# Altium schematic sheet LCD_NET_GPIO_JTAG_SD_USB.SchDoc
size A4; SheetNumber: 4; SheetTotal: 5
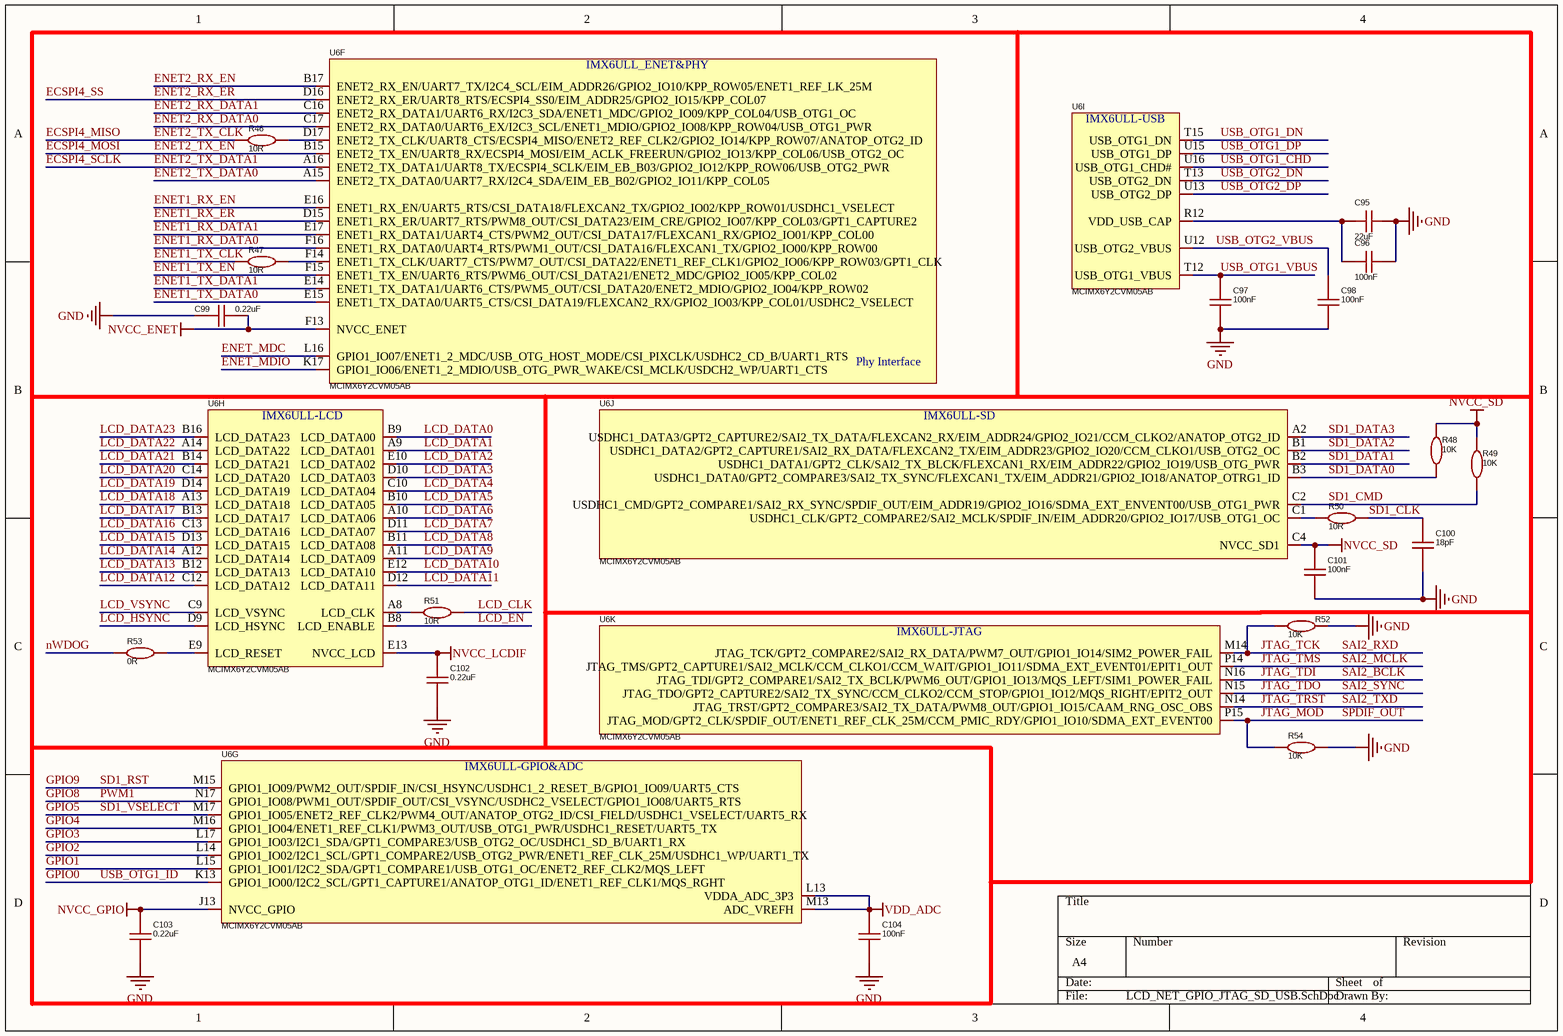
[diagram p0: LCD_NET_GPIO_JTAG_SD_USB.SchDoc]

## Parts
C95  22uF  [C0603]
C96  100nF  [C0402]
C97  100nF  [C0402]
C98  100nF  [C0402]
C99  0.22uF  [C0402]
C100  18pF  [C0402]
C101  100nF  [C0402]
C102  0.22uF  [C0402]
C103  0.22uF  [C0402]
C104  100nF  [C0402]
R46  10R  [R0402]
R47  10R  [R0402]
R48  10K  [R0402]
R49  10K  [R0402]
R50  10R  [R0402]
R51  10R  [R0402]
R52  10K  [R0402]
R53  0R  [R0402]
R54  10K  [R0402]
U6  MCIMX6Y2CVM05AB  [BGA-289_L14.0-W14.0-R17-C17-P0.80-BL]  (parts F,G,H,I,J,K of 12)

## Nets
GND: C95.2 C96.2 C97.1 C98.1 C99.2 C100.1 C101.1 C102.2 C103.2 C104.1 R52.1 R54.1
NVCC_ENET: C99.1 U6.F13(NVCC_ENET)
NVCC_GPIO: C103.1 U6.J13(NVCC_GPIO)
NVCC_LCDIF: C102.1 U6.E13(NVCC_LCD)
NVCC_SD: C101.2 R48.2 R49.2 U6.C4(NVCC_SD1)
VDD_ADC: C104.2 U6.L13(VDDA_ADC_3P3) U6.M13(ADC_VREFH)
ECSPI4_MISO: R46.1  [also labelled ENET2_TX_CLK]
ECSPI4_MOSI: U6.B15(ENET2_TX_EN/UART8_RX/ECSPI4_MOSI/EIM_ACLK_FREERUN/GPIO2_IO13/KPP_COL06/USB_OTG2_OC)  [also labelled ENET2_TX_EN]
ECSPI4_SCLK: U6.A16(ENET2_TX_DATA1/UART8_TX/ECSPI4_SCLK/EIM_EB_B03/GPIO2_IO12/KPP_ROW06/USB_OTG2_PWR)  [also labelled ENET2_TX_DATA1]
ECSPI4_SS: U6.D16(ENET2_RX_ER/UART8_RTS/ECSPI4_SS0/EIM_ADDR25/GPIO2_IO15/KPP_COL07)  [also labelled ENET2_RX_ER]
ENET1_RX_DATA0: U6.F16(ENET1_RX_DATA0/UART4_RTS/PWM1_OUT/CSI_DATA16/FLEXCAN1_TX/GPIO2_IO00/KPP_ROW00)
ENET1_RX_DATA1: U6.E17(ENET1_RX_DATA1/UART4_CTS/PWM2_OUT/CSI_DATA17/FLEXCAN1_RX/GPIO2_IO01/KPP_COL00)
ENET1_RX_EN: U6.E16(ENET1_RX_EN/UART5_RTS/CSI_DATA18/FLEXCAN2_TX/GPIO2_IO02/KPP_ROW01/USDHC1_VSELECT)
ENET1_RX_ER: U6.D15(ENET1_RX_ER/UART7_RTS/PWM8_OUT/CSI_DATA23/EIM_CRE/GPIO2_IO07/KPP_COL03/GPT1_CAPTURE2)
ENET1_TX_CLK: R47.1
ENET1_TX_DATA0: U6.E15(ENET1_TX_DATA0/UART5_CTS/CSI_DATA19/FLEXCAN2_RX/GPIO2_IO03/KPP_COL01/USDHC2_VSELECT)
ENET1_TX_DATA1: U6.E14(ENET1_TX_DATA1/UART6_CTS/PWM5_OUT/CSI_DATA20/ENET2_MDIO/GPIO2_IO04/KPP_ROW02)
ENET1_TX_EN: U6.F15(ENET1_TX_EN/UART6_RTS/PWM6_OUT/CSI_DATA21/ENET2_MDC/GPIO2_IO05/KPP_COL02)
ENET2_RX_DATA0: U6.C17(ENET2_RX_DATA0/UART6_EX/I2C3_SCL/ENET1_MDIO/GPIO2_IO08/KPP_ROW04/USB_OTG1_PWR)
ENET2_RX_DATA1: U6.C16(ENET2_RX_DATA1/UART6_RX/I2C3_SDA/ENET1_MDC/GPIO2_IO09/KPP_COL04/USB_OTG1_OC)
ENET2_RX_EN: U6.B17(ENET2_RX_EN/UART7_TX/I2C4_SCL/EIM_ADDR26/GPIO2_IO10/KPP_ROW05/ENET1_REF_LK_25M)
ENET2_TX_DATA0: U6.A15(ENET2_TX_DATA0/UART7_RX/I2C4_SDA/EIM_EB_B02/GPIO2_IO11/KPP_COL05)
ENET_MDC: U6.L16(GPIO1_IO07/ENET1_2_MDC/USB_OTG_HOST_MODE/CSI_PIXCLK/USDHC2_CD_B/UART1_RTS)
ENET_MDIO: U6.K17(GPIO1_IO06/ENET1_2_MDIO/USB_OTG_PWR_WAKE/CSI_MCLK/USDCH2_WP/UART1_CTS)
GPIO0: U6.K13(GPIO1_IO00/I2C2_SCL/GPT1_CAPTURE1/ANATOP_OTG1_ID/ENET1_REF_CLK1/MQS_RGHT)  [also labelled USB_OTG1_ID]
GPIO1: U6.L15(GPIO1_IO01/I2C2_SDA/GPT1_COMPARE1/USB_OTG1_OC/ENET2_REF_CLK2/MQS_LEFT)
GPIO2: U6.L14(GPIO1_IO02/I2C1_SCL/GPT1_COMPARE2/USB_OTG2_PWR/ENET1_REF_CLK_25M/USDHC1_WP/UART1_TX)
GPIO3: U6.L17(GPIO1_IO03/I2C1_SDA/GPT1_COMPARE3/USB_OTG2_OC/USDHC1_SD_B/UART1_RX)
GPIO4: U6.M16(GPIO1_IO04/ENET1_REF_CLK1/PWM3_OUT/USB_OTG1_PWR/USDHC1_RESET/UART5_TX)
GPIO5: U6.M17(GPIO1_IO05/ENET2_REF_CLK2/PWM4_OUT/ANATOP_OTG2_ID/CSI_FIELD/USDHC1_VSELECT/UART5_RX)  [also labelled SD1_VSELECT]
GPIO8: U6.N17(GPIO1_IO08/PWM1_OUT/SPDIF_OUT/CSI_VSYNC/USDHC2_VSELECT/GPIO1_IO08/UART5_RTS)  [also labelled PWM1]
GPIO9: U6.M15(GPIO1_IO09/PWM2_OUT/SPDIF_IN/CSI_HSYNC/USDHC1_2_RESET_B/GPIO1_IO09/UART5_CTS)  [also labelled SD1_RST]
JTAG_MOD: R54.2 U6.P15(JTAG_MOD/GPT2_CLK/SPDIF_OUT/ENET1_REF_CLK_25M/CCM_PMIC_RDY/GPIO1_IO10/SDMA_EXT_EVENT00)  [also labelled SPDIF_OUT]
JTAG_TCK: R52.2 U6.M14(JTAG_TCK/GPT2_COMPARE2/SAI2_RX_DATA/PWM7_OUT/GPIO1_IO14/SIM2_POWER_FAIL)  [also labelled SAI2_RXD]
JTAG_TDI: U6.N16(JTAG_TDI/GPT2_COMPARE1/SAI2_TX_BCLK/PWM6_OUT/GPIO1_IO13/MQS_LEFT/SIM1_POWER_FAIL)  [also labelled SAI2_BCLK]
JTAG_TDO: U6.N15(JTAG_TDO/GPT2_CAPTURE2/SAI2_TX_SYNC/CCM_CLKO2/CCM_STOP/GPIO1_IO12/MQS_RIGHT/EPIT2_OUT)  [also labelled SAI2_SYNC]
JTAG_TMS: U6.P14(JTAG_TMS/GPT2_CAPTURE1/SAI2_MCLK/CCM_CLKO1/CCM_WAIT/GPIO1_IO11/SDMA_EXT_EVENT01/EPIT1_OUT)  [also labelled SAI2_MCLK]
JTAG_TRST: U6.N14(JTAG_TRST/GPT2_COMPARE3/SAI2_TX_DATA/PWM8_OUT/GPIO1_IO15/CAAM_RNG_OSC_OBS)  [also labelled SAI2_TXD]
LCD_CLK: R51.2
LCD_DATA0: U6.B9(LCD_DATA00)
LCD_DATA1: U6.A9(LCD_DATA01)
LCD_DATA2: U6.E10(LCD_DATA02)
LCD_DATA3: U6.D10(LCD_DATA03)
LCD_DATA4: U6.C10(LCD_DATA04)
LCD_DATA5: U6.B10(LCD_DATA05)
LCD_DATA6: U6.A10(LCD_DATA06)
LCD_DATA7: U6.D11(LCD_DATA07)
LCD_DATA8: U6.B11(LCD_DATA08)
LCD_DATA9: U6.A11(LCD_DATA09)
LCD_DATA10: U6.E12(LCD_DATA10)
LCD_DATA11: U6.D12(LCD_DATA11)
LCD_DATA12: U6.C12(LCD_DATA12)
LCD_DATA13: U6.B12(LCD_DATA13)
LCD_DATA14: U6.A12(LCD_DATA14)
LCD_DATA15: U6.D13(LCD_DATA15)
LCD_DATA16: U6.C13(LCD_DATA16)
LCD_DATA17: U6.B13(LCD_DATA17)
LCD_DATA18: U6.A13(LCD_DATA18)
LCD_DATA19: U6.D14(LCD_DATA19)
LCD_DATA20: U6.C14(LCD_DATA20)
LCD_DATA21: U6.B14(LCD_DATA21)
LCD_DATA22: U6.A14(LCD_DATA22)
LCD_DATA23: U6.B16(LCD_DATA23)
LCD_EN: U6.B8(LCD_ENABLE)
LCD_HSYNC: U6.D9(LCD_HSYNC)
LCD_VSYNC: U6.C9(LCD_VSYNC)
nWDOG: R53.1
SD1_CLK: C100.2 R50.2
SD1_CMD: R49.1 U6.C2(USDHC1_CMD/GPT2_COMPARE1/SAI2_RX_SYNC/SPDIF_OUT/EIM_ADDR19/GPIO2_IO16/SDMA_EXT_ENVENT00/USB_OTG1_PWR)
SD1_DATA0: R48.1 U6.B3(USDHC1_DATA0/GPT2_COMPARE3/SAI2_TX_SYNC/FLEXCAN1_TX/EIM_ADDR21/GPIO2_IO18/ANATOP_OTRG1_ID)
SD1_DATA1: U6.B2(USDHC1_DATA1/GPT2_CLK/SAI2_TX_BLCK/FLEXCAN1_RX/EIM_ADDR22/GPIO2_IO19/USB_OTG_PWR)
SD1_DATA2: U6.B1(USDHC1_DATA2/GPT2_CAPTURE1/SAI2_RX_DATA/FLEXCAN2_TX/EIM_ADDR23/GPIO2_IO20/CCM_CLKO1/USB_OTG2_OC)
SD1_DATA3: U6.A2(USDHC1_DATA3/GPT2_CAPTURE2/SAI2_TX_DATA/FLEXCAN2_RX/EIM_ADDR24/GPIO2_IO21/CCM_CLKO2/ANATOP_OTG2_ID)
USB_OTG1_CHD: U6.U16(USB_OTG1_CHD#)
USB_OTG1_DN: U6.T15(USB_OTG1_DN)
USB_OTG1_DP: U6.U15(USB_OTG1_DP)
USB_OTG1_VBUS: C97.2 U6.T12(USB_OTG1_VBUS)
USB_OTG2_DN: U6.T13(USB_OTG2_DN)
USB_OTG2_DP: U6.U13(USB_OTG2_DP)
USB_OTG2_VBUS: C98.2 U6.U12(USB_OTG2_VBUS)
NetC95_1: C95.1 C96.1 U6.R12(VDD_USB_CAP)
NetR46_2: R46.2 U6.D17(ENET2_TX_CLK/UART8_CTS/ECSPI4_MISO/ENET2_REF_CLK2/GPIO2_IO14/KPP_ROW07/ANATOP_OTG2_ID)
NetR47_2: R47.2 U6.F14(ENET1_TX_CLK/UART7_CTS/PWM7_OUT/CSI_DATA22/ENET1_REF_CLK1/GPIO2_IO06/KPP_ROW03/GPT1_CLK)
NetR50_1: R50.1 U6.C1(USDHC1_CLK/GPT2_COMPARE2/SAI2_MCLK/SPDIF_IN/EIM_ADDR20/GPIO2_IO17/USB_OTG1_OC)
NetR51_1: R51.1 U6.A8(LCD_CLK)
NetR53_2: R53.2 U6.E9(LCD_RESET)

## Notes on the sheet
- (in symbol MCIMX6Y2CVM05AB, part F) IMX6ULL_ENET&PHY; Phy Interface
- (in symbol MCIMX6Y2CVM05AB, part G) IMX6ULL-GPIO&ADC
- (in symbol MCIMX6Y2CVM05AB, part H) IMX6ULL-LCD
- (in symbol MCIMX6Y2CVM05AB, part I) IMX6ULL-USB
- (in symbol MCIMX6Y2CVM05AB, part J) IMX6ULL-SD
- (in symbol MCIMX6Y2CVM05AB, part K) IMX6ULL-JTAG

## Library data of the parts
C95 = C0603: 容值:22uF;精度:±20%;额定电压:10V;材质(温度系数):X5R;; Manufacturer: Chinocera(华瓷); Symbol: HGC0603R5226M100NTHJ; Add into BOM: yes; Tolerance: ±20%; Voltage Rated: 10V; Temperature Coefficient: X5R; Device: HGC0603R5226M100NTHJ; LCSC Part Name: 22uF ±20% 10V; Supplier Part: C7432770; Manufacturer Part: HGC0603R5226M100NTHJ; Supplier Footprint: 0603; JLCPCB Part Class: 扩展库; Datasheet: https://atta.szlcsc.com/upload/public/pdf/source/20240320/FAC3FEC40A78BC5CCCE96C232A94D860.pdf; Supplier: LCSC; Convert to PCB: yes; Value: 22uF
C96-C98 C101 C104 = C0402: 容值:100nF;精度:±10%;额定电压:50V;材质(温度系数):X7R;; Manufacturer: muRata(村田); Symbol: GRM155R71H104KE14D; Add into BOM: yes; Tolerance: ±10%; Voltage Rated: 50V; Temperature Coefficient: X7R; Device: GRM155R71H104KE14D; LCSC Part Name: 100nF ±10% 50V; Supplier Part: C77020; Manufacturer Part: GRM155R71H104KE14D; Supplier Footprint: 0402; JLCPCB Part Class: 扩展库; Datasheet: https://atta.szlcsc.com/upload/public/pdf/source/20180326/C77020_39BD49C951FF1AF0DB1F1FAC5AC1E401.pdf; Supplier: LCSC; Convert to PCB: yes; Value: 100nF
C99 C100 C102 C103 = C0402: 容值:100nF;精度:±10%;额定电压:50V;材质(温度系数):X7R;; Manufacturer: muRata(村田); Symbol: GRM155R71H104KE14D; Add into BOM: yes; Value: 100nF; Tolerance: ±10%; Voltage Rated: 50V; Temperature Coefficient: X7R; Device: GRM155R71H104KE14D; LCSC Part Name: 100nF ±10% 50V; Supplier Part: C77020; Manufacturer Part: GRM155R71H104KE14D; Supplier Footprint: 0402; JLCPCB Part Class: 扩展库; Datasheet: https://atta.szlcsc.com/upload/public/pdf/source/20180326/C77020_39BD49C951FF1AF0DB1F1FAC5AC1E401.pdf; Supplier: LCSC; Convert to PCB: yes
R46-R54 = R0402: 电阻类型:厚膜电阻;阻值:1kΩ;精度:±1%;功率:62.5mW;最大工作电压:50V;温度系数:±100ppm/℃;; Manufacturer: UNI-ROYAL(厚声); Symbol: 0402WGF1001TCE; Add into BOM: yes; Value: 1kΩ; Tolerance: ±1%; Power(Watts): 62.5mW; Overload Voltage (Max): 50V; Device: 0402WGF1001TCE; LCSC Part Name: 1kΩ ±1% 62.5mW 厚膜电阻; Supplier Part: C11702; Manufacturer Part: 0402WGF1001TCE; Supplier Footprint: 0402; JLCPCB Part Class: 基础库; Datasheet: https://atta.szlcsc.com/upload/public/pdf/source/20200306/C422600_1E6D84923E4A46A82E41ADD87F860B5C.pdf; Supplier: LCSC; Convert to PCB: yes; Type: 厚膜电阻; Temperature Coefficient: ±100ppm/℃; Operating Temperature Range: -55℃~+155℃
U6 = MCIMX6Y2CVM05AB: CPU内核:ARM-A系列;RAM总容量:128KB;GPIO端口数量:-;工作电压范围:-;CPU最大主频:528MHz;程序存储器类型:-;应用领域:-;; Manufacturer: NXP(恩智浦); Add into BOM: yes; RAM Size: 128KB; CPU Maximum Speed: 528MHz; ADC (Bit): 12bit; UART/USART: 8; I2C: 4; Universal Serial Bus: 有; Peripheral/Function: 真随机数发生器; Symbol: MCIMX6Y2CVM05AB; Device: MCIMX6Y2CVM05AB; LCSC Part Name: MCIMX6Y2CVM05AB; Supplier Part: C394783; Manufacturer Part: MCIMX6Y2CVM05AB; Supplier Footprint: MAPBGA-289(14x14); JLCPCB Part Class: 扩展库; Datasheet: https://atta.szlcsc.com/upload/public/pdf/source/20190903/C414057_F91A491E37DFDD32A6FE61E7D0CA74B1.pdf; Supplier: LCSC; Convert to PCB: yes; CPU Core: ARM-A系列; GPIO Ports Number: -; Operating Voltage Range: -; Program Memory Type: -; Operating Temperature Range: -40℃~+105℃; DAC (Bit): -; PWM (Bit): -; 8Bit Timer: -; 16Bit Timer: -; 32Bit Timer: -; CAN: -; I2S: -; SPI: 4; Internal Comparator: -; communication protocol: -; Watchdog: -; Real-Time Clock: -; Infrared Data Association: -; Low-Voltage Detect: -; CCP Capture/Compare: -; LCD Module: 有; LED Module: -; Secure Digital Input and Output: -; Direct Memory Access: -; Internal Oscillator: -; Application Area: -